# Altium schematic sheet PCA9685.SchDoc
size A4
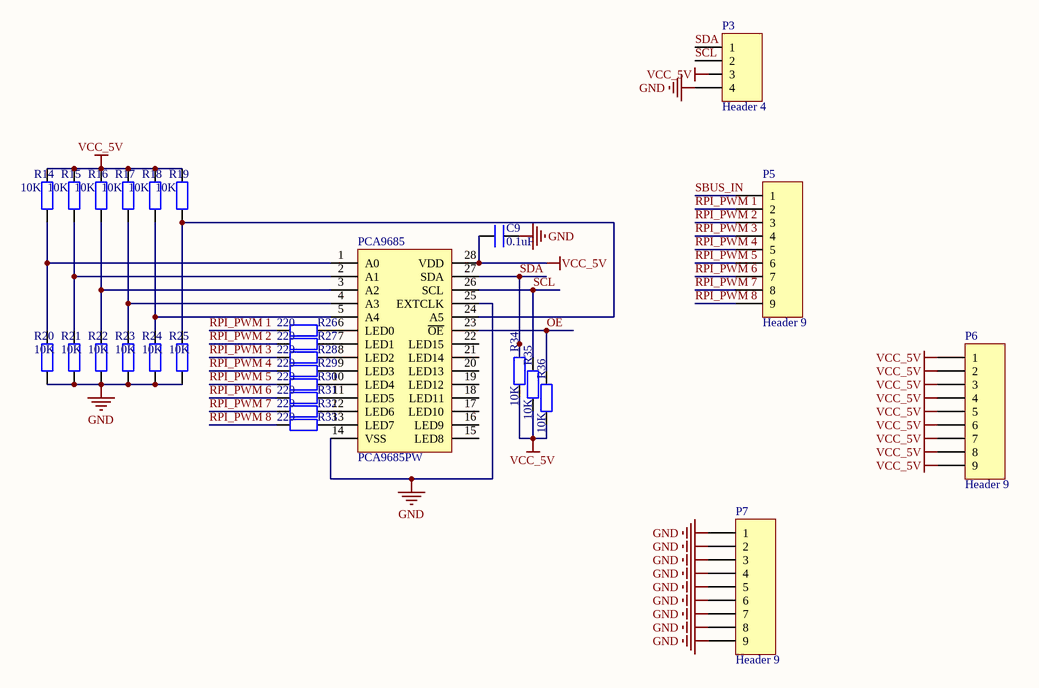
[diagram p0: PCA9685.SchDoc]

## Parts
C9  0.1uF  [0805]
P3  Header 4  [HDR1X4]
P5  Header 9  [HDR1X9]
P6  Header 9  [HDR1X9]
P7  Header 9  [HDR1X9]
PCA9685  PCA9685PW  [PCA9685PW]
R14  value 10K  [0805]  (hidden comment: Res2)
R15  value 10K  [0805]  (hidden comment: Res2)
R16  value 10K  [0805]  (hidden comment: Res2)
R17  value 10K  [0805]  (hidden comment: Res2)
R18  value 10K  [0805]  (hidden comment: Res2)
R19  value 10K  [0805]  (hidden comment: Res2)
R20  value 10K  [0805]  (hidden comment: Res2)
R21  value 10K  [0805]  (hidden comment: Res2)
R22  value 10K  [0805]  (hidden comment: Res2)
R23  value 10K  [0805]  (hidden comment: Res2)
R24  value 10K  [0805]  (hidden comment: Res2)
R25  value 10K  [0805]  (hidden comment: Res2)
R26  value 220  [0805]  (hidden comment: Res2)
R27  value 220  [0805]  (hidden comment: Res2)
R28  value 220  [0805]  (hidden comment: Res2)
R29  value 220  [0805]  (hidden comment: Res2)
R30  value 220  [0805]  (hidden comment: Res2)
R31  value 220  [0805]  (hidden comment: Res2)
R32  value 220  [0805]  (hidden comment: Res2)
R33  value 220  [0805]  (hidden comment: Res2)
R34  value 10K  [0805]  (hidden comment: Res2)
R35  value 10K  [0805]  (hidden comment: Res2)
R36  value 10K  [0805]  (hidden comment: Res2)

## Nets
GND: C9.2 P3.4 P7.1 P7.2 P7.3 P7.4 P7.5 P7.6 P7.7 P7.8 P7.9 PCA9685.14(VSS) PCA9685.25(EXTCLK) R20.2 R21.2 R22.2 R23.2 R24.2 R25.2
VCC_5V: C9.1 P6.1 P6.2 P6.3 P6.4 P6.5 P6.6 P6.7 P6.8 P6.9 PCA9685.28(VDD) R14.1 R15.1 R16.1 R17.1 R18.1 R19.1 R34.2 R35.2 R36.2
OE: PCA9685.23(~{OE}) R36.1
RPI_PWM 1: P5.2 R26.1
RPI_PWM 2: P5.3 R27.1
RPI_PWM 3: P5.4 R28.1
RPI_PWM 4: P5.5 R29.1
RPI_PWM 5: P5.6 R30.1
RPI_PWM 6: P5.7 R31.1
RPI_PWM 7: P5.8 R32.1
RPI_PWM 8: P5.9 R33.1
SBUS_IN: P5.1
SCL: P3.2 PCA9685.26(SCL) R35.1
SDA: P3.1 PCA9685.27(SDA) R34.1
NetPCA9685_1: PCA9685.1(A0) R14.2 R20.1
NetPCA9685_2: PCA9685.2(A1) R15.2 R21.1
NetPCA9685_3: PCA9685.3(A2) R16.2 R22.1
NetPCA9685_4: PCA9685.4(A3) R17.2 R23.1
NetPCA9685_5: PCA9685.5(A4) R18.2 R24.1
NetPCA9685_6: PCA9685.6(LED0) R26.2
NetPCA9685_7: PCA9685.7(LED1) R27.2
NetPCA9685_8: PCA9685.8(LED2) R28.2
NetPCA9685_9: PCA9685.9(LED3) R29.2
NetPCA9685_10: PCA9685.10(LED4) R30.2
NetPCA9685_11: PCA9685.11(LED5) R31.2
NetPCA9685_12: PCA9685.12(LED6) R32.2
NetPCA9685_13: PCA9685.13(LED7) R33.2
NetPCA9685_24: PCA9685.24(A5) R19.2 R25.1

Not connected (* = marked no-connect by the designer): P3 3; PCA9685 15(LED8) 16(LED9) 17(LED10) 18(LED11) 19(LED12) 20(LED13) 21(LED14) 22(LED15)

## Notes on the sheet
- Labels drawn without touching a wire or pin: VCC_5V

## Library data of the parts
C9 = C
P3 = Header 4: Header, 4-Pin; LatestRevisionDate: 17-Jul-2002; LatestRevisionNote: Re-released for DXP Platform.; Publisher: Altium Limited
P5-P7 = Header 9: Header, 9-Pin; LatestRevisionDate: 17-Jul-2002; LatestRevisionNote: Re-released for DXP Platform.; Publisher: Altium Limited
R14-R36 = Res2: Resistor; Published: 8-Jun-2000; LatestRevisionDate: 17-Jul-2002; LatestRevisionNote: Re-released for DXP Platform.; PackageReference: AXIAL-0.4; Publisher: Altium Limited; PackageDescription: Axial Device, Thru-Hole; 2 Leads; 0.4 in Pin Spacing